# Altium schematic sheet 纠偏机电路图(TZ).SchDoc
size B; SheetNumber: 0; SheetTotal: 0
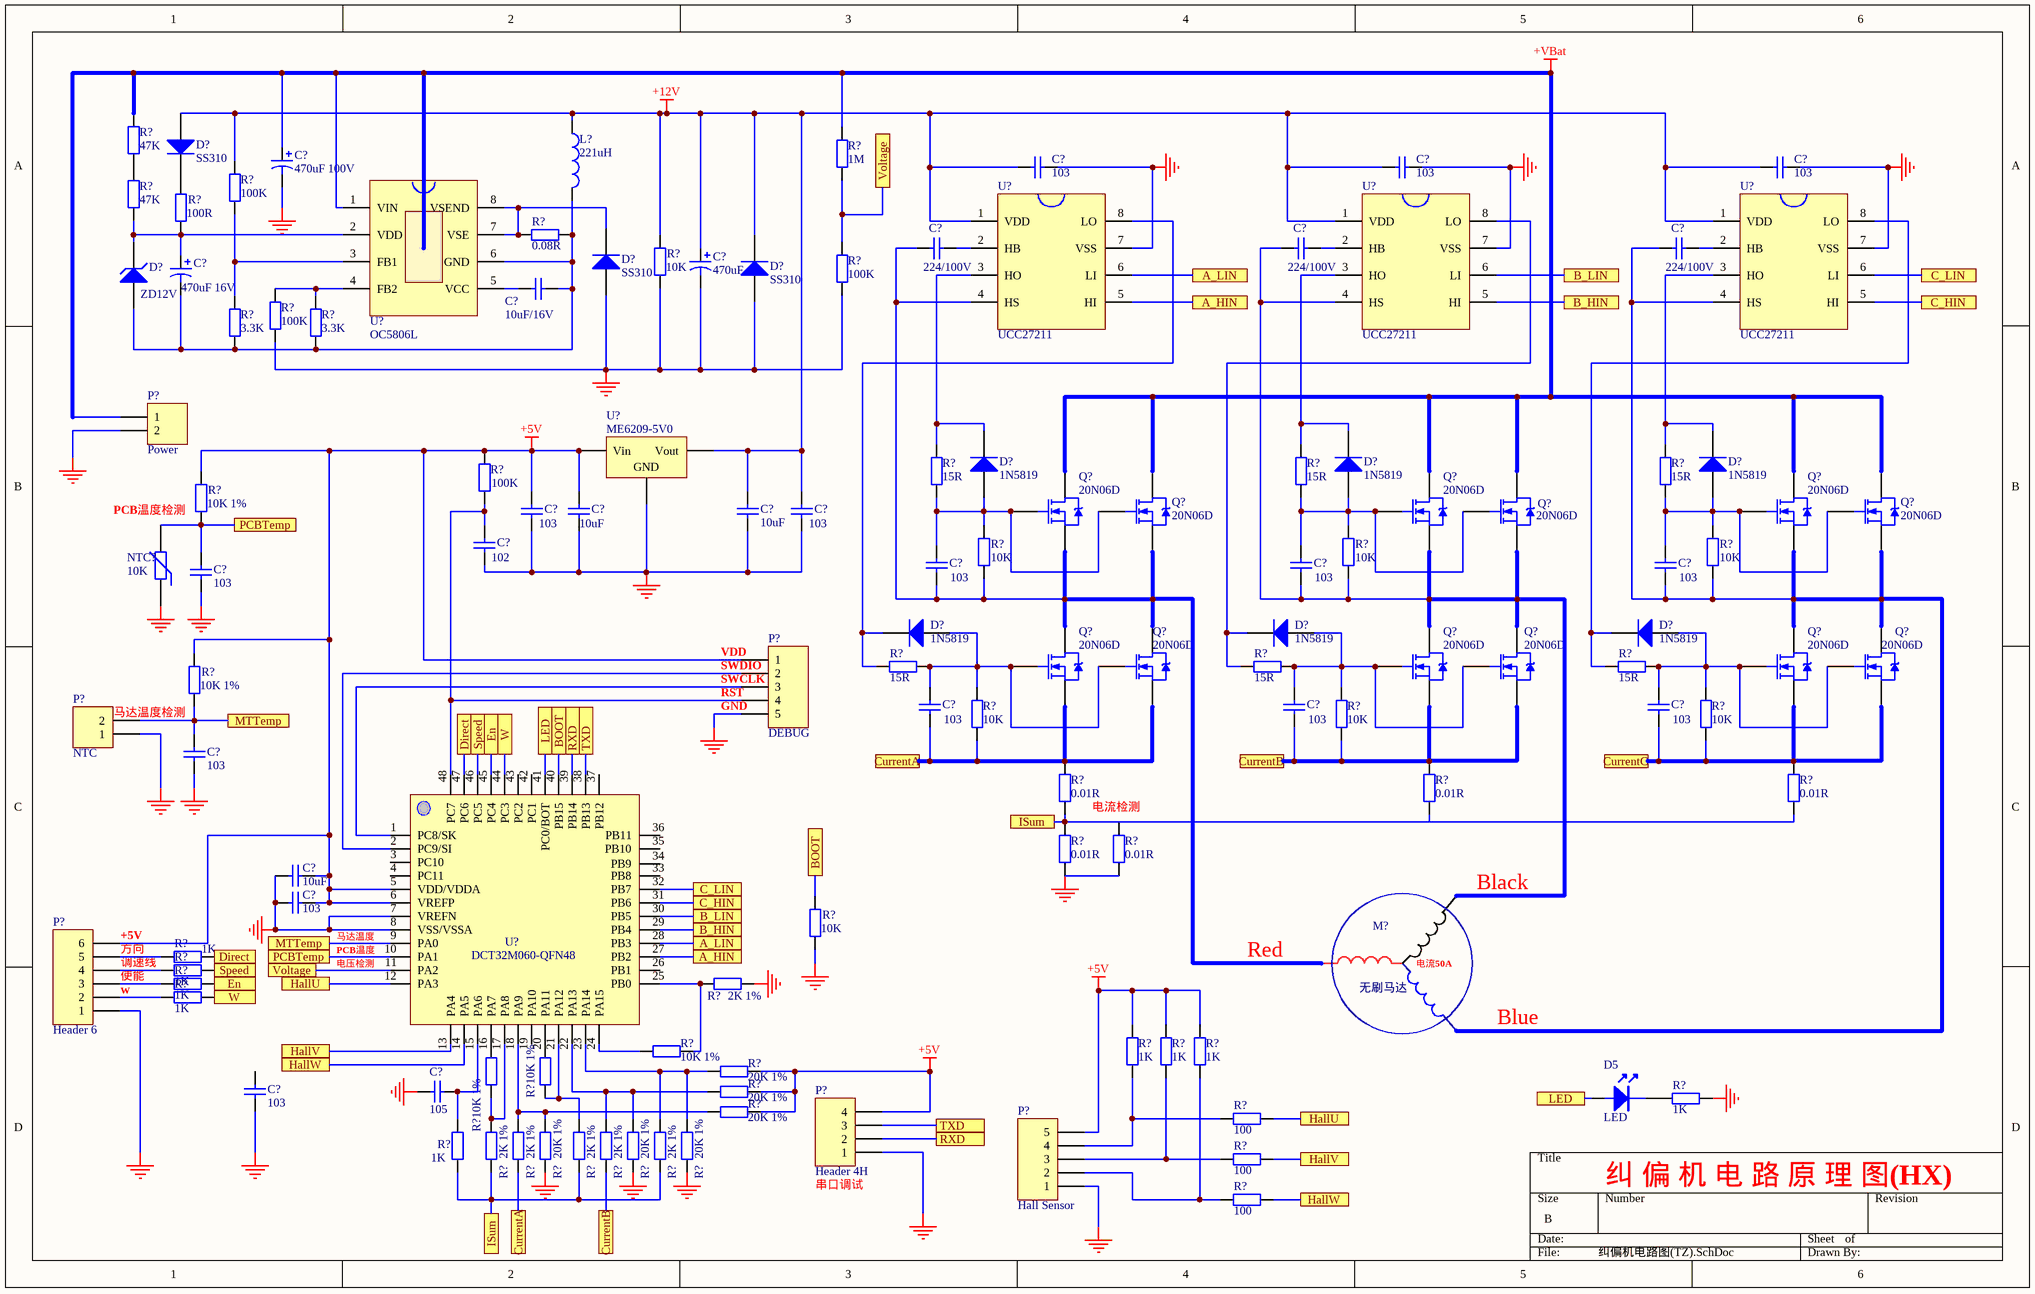
[diagram p0: 纠偏机电路图(TZ).SchDoc]

## Parts
(Parts that share a designator on the sheet are numbered #1, #2 ... from top to bottom, then left to right.)
C?#1  value 470uF 100V  [C0805]  (hidden comment: Cap Pol3)
C?#2  value 103  [RAD-0.3]
C?#3  value 103  [RAD-0.3]
C?#4  value 103  [RAD-0.3]
C?#5  value 224/100V  [RAD-0.3]
C?#6  value 224/100V  [RAD-0.3]
C?#7  value 224/100V  [RAD-0.3]
C?#8  value 470uF  [C0805]  (hidden comment: Cap Pol3)
C?#9  value 470uF 16V  [C0805]  (hidden comment: Cap Pol3)
C?#10  value 10uF/16V  [RAD-0.3]  (hidden comment: Cap)
C?#11  value 10uF  [RAD-0.3]
C?#12  value 103  [RAD-0.3]
C?#13  value 10uF  [RAD-0.3]  (hidden comment: Cap)
C?#14  value 103  [RAD-0.3]
C?#15  value 102  [RAD-0.3]
C?#16  value 103  [RAD-0.3]
C?#17  value 103  [RAD-0.3]
C?#18  value 103  [RAD-0.3]
C?#19  value 103  [RAD-0.3]  (hidden comment: Cap)
C?#20  value 103  [RAD-0.3]
C?#21  value 103  [RAD-0.3]
C?#22  value 103  [RAD-0.3]
C?#23  value 103  [RAD-0.3]  (hidden comment: Cap)
C?#24  value 10uF  [RAD-0.3]  (hidden comment: Cap)
C?#25  value 103  [RAD-0.3]  (hidden comment: Cap)
C?#26  value 103  [RAD-0.3]  (hidden comment: Cap)
C?#27  value 105  [RAD-0.3]  (hidden comment: Cap)
D5  LED  [LED]
D?#1  SS310  [SMC]
D?#2  SS310  [SMC]
D?#3  SS310  [SMC]
D?#4  ZD12V  [DIODE-0.7]
D?#5  1N5819  [SMC]
D?#6  1N5819  [SMC]
D?#7  1N5819  [SMC]
D?#8  1N5819  [SMC]
D?#9  1N5819  [SMC]
D?#10  1N5819  [SMC]
L?  value 221uH  [0402-A]  (hidden comment: Inductor)
M?  无刷马达
NTC?  10K  [6-0805_N]
P?#1  Power  [HDR1X2]
P?#2  DEBUG  [HDR1X5]
P?#3  NTC  [HDR1X2]
P?#4  Header 6  [HDR1X6]
P?#5  Header 4H  [HDR1X4H]
P?#6  Hall Sensor  [HDR1X5]
Q?#1  20N06D  [TO-220AB]
Q?#2  20N06D  [TO-220AB]
Q?#3  20N06D  [TO-220AB]
Q?#4  20N06D  [TO-220AB]
Q?#5  20N06D  [TO-220AB]
Q?#6  20N06D  [TO-220AB]
Q?#7  20N06D  [TO-220AB]
Q?#8  20N06D  [TO-220AB]
Q?#9  20N06D  [TO-220AB]
Q?#10  20N06D  [TO-220AB]
Q?#11  20N06D  [TO-220AB]
Q?#12  20N06D  [TO-220AB]
R?#1  value 47K  [AXIAL-0.4]  (hidden comment: Res2)
R?#2  value 1M  [AXIAL-0.4]  (hidden comment: Res2)
R?#3  value 100K  [AXIAL-0.4]  (hidden comment: Res2)
R?#4  value 47K  [AXIAL-0.4]  (hidden comment: Res2)
R?#5  value 100R  [AXIAL-0.4]  (hidden comment: Res2)
R?#6  value 0.08R  [AXIAL-0.4]  (hidden comment: Res2)
R?#7  value 10K  [AXIAL-0.4]  (hidden comment: Res2)
R?#8  value 100K  [AXIAL-0.4]  (hidden comment: Res2)
R?#9  value 100K  [AXIAL-0.4]  (hidden comment: Res2)
R?#10  value 3.3K  [AXIAL-0.4]  (hidden comment: Res2)
R?#11  value 3.3K  [AXIAL-0.4]  (hidden comment: Res2)
R?#12  value 10K 1%  [AXIAL-0.4]  (hidden comment: Res2)
R?#13  value 15R  [AXIAL-0.4]  (hidden comment: Res2)
R?#14  value 15R  [AXIAL-0.4]  (hidden comment: Res2)
R?#15  value 15R  [AXIAL-0.4]  (hidden comment: Res2)
R?#16  value 100K  [AXIAL-0.4]  (hidden comment: Res2)
R?#17  value 10K  [AXIAL-0.4]  (hidden comment: Res2)
R?#18  value 10K  [AXIAL-0.4]  (hidden comment: Res2)
R?#19  value 10K  [AXIAL-0.4]  (hidden comment: Res2)
R?#20  value 10K 1%  [AXIAL-0.4]  (hidden comment: Res2)
R?#21  value 15R  [AXIAL-0.4]  (hidden comment: Res2)
R?#22  value 15R  [AXIAL-0.4]  (hidden comment: Res2)
R?#23  value 15R  [AXIAL-0.4]  (hidden comment: Res2)
R?#24  value 10K  [AXIAL-0.4]  (hidden comment: Res2)
R?#25  value 10K  [AXIAL-0.4]  (hidden comment: Res2)
R?#26  value 10K  [AXIAL-0.4]  (hidden comment: Res2)
R?#27  value 0.01R  [AXIAL-0.4]  (hidden comment: Res2)
R?#28  value 0.01R  [AXIAL-0.4]  (hidden comment: Res2)
R?#29  value 0.01R  [AXIAL-0.4]  (hidden comment: Res2)
R?#30  value 0.01R  [AXIAL-0.4]  (hidden comment: Res2)
R?#31  value 0.01R  [AXIAL-0.4]  (hidden comment: Res2)
R?#32  value 10K  [AXIAL-0.4]  (hidden comment: Res2)
R?#33  value 1K  [AXIAL-0.4]  (hidden comment: Res2)
R?#34  value 1K  [AXIAL-0.4]  (hidden comment: Res2)
R?#35  value 1K  [AXIAL-0.4]  (hidden comment: Res2)
R?#36  value 1K  [AXIAL-0.4]  (hidden comment: Res2)
R?#37  value 2K 1%  [AXIAL-0.4]  (hidden comment: Res2)
R?#38  value 10K 1%  [AXIAL-0.4]  (hidden comment: Res2)
R?#39  value 1K  [AXIAL-0.4]  (hidden comment: Res2)
R?#40  value 1K  [AXIAL-0.4]  (hidden comment: Res2)
R?#41  value 1K  [AXIAL-0.4]  (hidden comment: Res2)
R?#42  value 10K 1%  [AXIAL-0.4]  (hidden comment: Res2)
R?#43  value 10K 1%  [AXIAL-0.4]  (hidden comment: Res2)
R?#44  value 20K 1%  [AXIAL-0.4]  (hidden comment: Res2)
R?#45  value 1K  [AXIAL-0.4]  (hidden comment: Res2)
R?#46  value 20K 1%  [AXIAL-0.4]  (hidden comment: Res2)
R?#47  value 20K 1%  [AXIAL-0.4]  (hidden comment: Res2)
R?#48  value 1K  [AXIAL-0.4]  (hidden comment: Res2)
R?#49  value 2K 1%  [AXIAL-0.4]  (hidden comment: Res2)
R?#50  value 20K 1%  [AXIAL-0.4]  (hidden comment: Res2)
R?#51  value 100  [AXIAL-0.4]  (hidden comment: Res2)
R?#52  value 2K 1%  [AXIAL-0.4]  (hidden comment: Res2)
R?#53  value 2K 1%  [AXIAL-0.4]  (hidden comment: Res2)
R?#54  value 20K 1%  [AXIAL-0.4]  (hidden comment: Res2)
R?#55  value 2K 1%  [AXIAL-0.4]  (hidden comment: Res2)
R?#56  value 2K 1%  [AXIAL-0.4]  (hidden comment: Res2)
R?#57  value 20K 1%  [AXIAL-0.4]  (hidden comment: Res2)
R?#58  value 100  [AXIAL-0.4]  (hidden comment: Res2)
R?#59  value 100  [AXIAL-0.4]  (hidden comment: Res2)
U?#1  OC5806L
U?#2  UCC27211
U?#3  UCC27211
U?#4  UCC27211
U?#5  ME6209-5V0  [D2PAK_N]
U?#6  DCT32M060-QFN48

## Ports
A_HIN, A_LIN, B_HIN, B_LIN, BOOT, C_HIN, C_LIN, CurrentA, CurrentB, CurrentC, Direct, En, HallU, HallV, HallW, ISum, LED, MTTemp, PCBTemp, RXD, Speed, TXD, Voltage, W

## Nets
+5V: C?#11.1 C?#12.2 C?#24.2 C?#25.1 P?#2.1 P?#4.6 P?#5.4 P?#6.5 R?#12.1 R?#16.2 R?#20.1 R?#39.2 R?#40.2 R?#41.2 R?#44.1 R?#46.1 R?#47.1 U?#5.1(Vin) U?#6.5(VDD/VDDA) U?#6.6(VREFP)
+12V: C?#2.2 C?#3.2 C?#4.2 C?#8.1 C?#13.2 C?#14.2 D?#1.1(A) D?#3.2(K) L?.1 R?#3.2 R?#7.1 U?#2.1(VDD) U?#3.1(VDD) U?#4.1(VDD) U?#5.3(Vout)
+VBat: C?#1.1 Q?#1.2(D) Q?#2.2(D) Q?#3.2(D) Q?#4.2(D) Q?#5.2(D) Q?#6.2(D) R?#1.1 R?#2.2 U?#1.1(VIN) U?#1.9
GND: C?#1.2 C?#2.1 C?#3.1 C?#4.1 C?#8.2 C?#11.2 C?#12.1 C?#13.1 C?#14.1 C?#15.1 C?#19.1 C?#23.1 C?#24.1 C?#25.2 C?#26.1 C?#27.2 D?#2.1(A) D?#3.1(A) NTC?.1 P?#2.5 P?#3.1 P?#4.1 P?#5.1 P?#6.1 R?#7.2 R?#8.1 R?#9.2 R?#30.2 R?#32.2 R?#37.1 R?#45.2 R?#50.2 R?#54.1 R?#57.1 U?#2.7(VSS) U?#3.7(VSS) U?#4.7(VSS) U?#5.2(GND) U?#6.7(VREFN) U?#6.8(VSS/VSSA)
A_HIN: U?#2.5(HI) U?#6.27(PB2) ; port A_HIN
A_LIN: U?#2.6(LI) U?#6.28(PB3) ; port A_LIN
B_HIN: U?#3.5(HI) U?#6.29(PB4) ; port B_HIN
B_LIN: U?#3.6(LI) U?#6.30(PB5) ; port B_LIN
BOOT: R?#32.1 U?#6.40(PB15) ; port BOOT
C_HIN: U?#4.5(HI) U?#6.31(PB6) ; port C_HIN
C_LIN: U?#4.6(LI) U?#6.32(PB7) ; port C_LIN
CurrentA: C?#20.2 Q?#7.3(S) Q?#8.3(S) R?#24.1 R?#27.1 R?#53.1 ; port CurrentA
CurrentB: C?#21.2 Q?#9.3(S) Q?#10.3(S) R?#25.1 R?#28.1 R?#56.1 ; port CurrentB
CurrentC: C?#22.2 Q?#11.3(S) Q?#12.3(S) R?#26.1 R?#29.1 ; port CurrentC
Direct: R?#33.2 U?#6.47(PC6) ; port Direct
En: R?#35.2 U?#6.45(PC4) ; port En
HallU: R?#51.1 U?#6.12(PA3) ; port HallU
HallV: R?#58.1 U?#6.13(PA4) ; port HallV
HallW: R?#59.1 U?#6.14(PA5) ; port HallW
ISum: R?#30.1 R?#48.2 R?#49.2 R?#52.1 R?#55.1 ; port ISum
LED: D5.1 U?#6.41(PC0/BOT) ; port LED
MTTemp: C?#23.2 P?#3.2 R?#20.2 U?#6.9(PA0) ; port MTTemp
PCBTemp: C?#19.2 NTC?.2 R?#12.2 U?#6.10(PA1) ; port PCBTemp
RXD: P?#5.2 U?#6.39(PB14) ; port RXD
Speed: R?#34.2 U?#6.46(PC5) ; port Speed
TXD: P?#5.3 U?#6.38(PB13) ; port TXD
Voltage: R?#2.1 R?#8.2 U?#6.11(PA2) ; port Voltage
W: R?#36.2 U?#6.44(PC3) ; port W
NetC?#5_1: C?#5.1 C?#16.2 Q?#1.3(S) Q?#2.3(S) Q?#7.2(D) Q?#8.2(D) R?#17.1 U?#2.4(HS)
NetC?#5_2: C?#5.2 U?#2.2(HB)
NetC?#6_1: C?#6.1 C?#17.2 Q?#3.3(S) Q?#4.3(S) Q?#9.2(D) Q?#10.2(D) R?#18.1 U?#3.4(HS)
NetC?#6_2: C?#6.2 U?#3.2(HB)
NetC?#7_1: C?#7.1 C?#18.2 Q?#5.3(S) Q?#6.3(S) Q?#11.2(D) Q?#12.2(D) R?#19.1 U?#4.4(HS)
NetC?#7_2: C?#7.2 U?#4.2(HB)
NetC?#9_1: C?#9.1 D?#4.2(K) R?#4.1 R?#5.1 U?#1.2(VDD)
NetC?#9_2: C?#9.2 C?#10.1 D?#4.1(A) L?.2 R?#6.1 R?#10.2 R?#11.2 U?#1.6(GND)
NetC?#10_2: C?#10.2 U?#1.5(VCC)
NetC?#15_2: C?#15.2 P?#2.4 R?#16.1 U?#6.48(PC7)
NetC?#16_1: C?#16.1 D?#5.1(A) Q?#1.1(G) Q?#2.1(G) R?#13.1 R?#17.2
NetC?#17_1: C?#17.1 D?#6.1(A) Q?#3.1(G) Q?#4.1(G) R?#14.1 R?#18.2
NetC?#18_1: C?#18.1 D?#7.1(A) Q?#5.1(G) Q?#6.1(G) R?#15.1 R?#19.2
NetC?#20_1: C?#20.1 D?#8.1(A) Q?#7.1(G) Q?#8.1(G) R?#21.1 R?#24.2
NetC?#21_1: C?#21.1 D?#9.1(A) Q?#9.1(G) Q?#10.1(G) R?#22.1 R?#25.2
NetC?#22_1: C?#22.1 D?#10.1(A) Q?#11.1(G) Q?#12.1(G) R?#23.1 R?#26.2
NetC?#27_1: C?#27.1 R?#48.1 U?#6.15(PA6)
NetD5_2: D5.2 R?#45.1
NetD?#1_2: D?#1.2(K) R?#5.2
NetD?#2_2: D?#2.2(K) R?#6.2 U?#1.7(VSE) U?#1.8(VSEND)
NetD?#5_2: D?#5.2(K) R?#13.2 U?#2.3(HO)
NetD?#6_2: D?#6.2(K) R?#14.2 U?#3.3(HO)
NetD?#7_2: D?#7.2(K) R?#15.2 U?#4.3(HO)
NetD?#8_2: D?#8.2(K) R?#21.2 U?#2.8(LO)
NetD?#9_2: D?#9.2(K) R?#22.2 U?#3.8(LO)
NetD?#10_2: D?#10.2(K) R?#23.2 U?#4.8(LO)
NetP?#2_2: P?#2.2 U?#6.2(PC9/SI)
NetP?#2_3: P?#2.3 U?#6.1(PC8/SK)
NetP?#4_2: P?#4.2 R?#36.1
NetP?#4_3: P?#4.3 R?#35.1
NetP?#4_4: P?#4.4 R?#34.1
NetP?#4_5: P?#4.5 R?#33.1
NetP?#6_2: P?#6.2 R?#41.1 R?#59.2
NetP?#6_3: P?#6.3 R?#40.1 R?#58.2
NetP?#6_4: P?#6.4 R?#39.1 R?#51.2
NetR?#1_2: R?#1.2 R?#4.2
NetR?#3_1: R?#3.1 R?#10.1 U?#1.3(FB1)
NetR?#9_1: R?#9.1 R?#11.1 U?#1.4(FB2)
NetR?#37_2: R?#37.2 R?#38.1 U?#6.25(PB0)
NetR?#38_2: R?#38.2 U?#6.24(PA15)
NetR?#42_1: R?#42.1 R?#52.2 U?#6.17(PA8)
NetR?#42_2: R?#42.2 U?#6.16(PA7)
NetR?#43_1: R?#43.1 R?#55.2 U?#6.21(PA12)
NetR?#43_2: R?#43.2 U?#6.20(PA11)
NetR?#44_2: R?#44.2 R?#49.1 R?#50.1 U?#6.23(PA14)
NetR?#46_2: R?#46.2 R?#56.2 R?#57.2 U?#6.22(PA13)
NetR?#47_2: R?#47.2 R?#53.2 R?#54.2 U?#6.18(PA9)

Not connected (* = marked no-connect by the designer): C?#26 2; P?#1 1 2; R?#27 2; R?#28 2; R?#29 2; R?#31 1 2; U?#6 3(PC10) 4(PC11) 19(PA10) 26(PB1) 33(PB8) 34(PB9) 35(PB10) 36(PB11) 37(PB12) 42(PC1) 43(PC2)

## Notes on the sheet
- PCB温度检测
- (near P?#2) VDD
- (near P?#2) RST
- (near P?#2) SWCLK
- (near P?#2) SWDIO
- (near P?#3) 马达温度检测
- (near P?#2) GND
- (near R?#31) 电流检测
- Black
- +5V
- 方向
- 调速线
- 电压检测
- 马达温度
- PCB温度
- Red
- (near M?) 电流50A
- (near P?#4) W
- 使能
- Blue
- (near P?#5) 串口调试
- 纠 偏 机 电 路 原 理 图(HX)
- Labels drawn without touching a wire or pin: GND

## Library data of the parts
C?#1 C?#8 C?#9 = Cap Pol3: Polarized Capacitor (Surface Mount); Published: 8-Jun-2000; LatestRevisionDate: 29-May-2009; LatestRevisionNote: IPC-7351 Footprint Added.; PackageReference: C0805; Publisher: Altium Limited; PackageDescription: Chip Capacitor
C?#2-C?#7 C?#10-C?#27 = Cap: Capacitor; Published: 8-Jun-2000; LatestRevisionDate: 17-Jul-2002; LatestRevisionNote: Re-released for DXP Platform.; PackageReference: RAD-0.3; Publisher: Altium Limited; PackageDescription: Radial Cap, Thru-Hole; 2 Leads; 0.3 in Pin Spacing
D?#1-D?#3 D?#5-D?#10 = Diode: Default Diode; Published: 8-Jun-2000; LatestRevisionDate: 17-Jul-2002; LatestRevisionNote: Re-released for DXP Platform.; PackageVersion: Sep-1996; PackageReference: SMC; Publisher: Altium Limited; PackageDescription: DO-214-AB/SMC; 2 C-Bend Leads; Body 7.9 x 5.9 mm, inc. leads (LxW); Code_JEDEC: DO-214-AB
D?#4 = D Zener: Zener Diode; Published: 8-Jun-2000; LatestRevisionDate: 17-Jul-2002; LatestRevisionNote: Re-released for DXP Platform.; PackageReference: DIODE-0.7; Publisher: Altium Limited; PackageDescription: Diode, Thru-Hole; 2 Leads; 0.7 in Pin Spacing
L? = Inductor: Code_IEC: 1005; Published: 8-Jun-2000; LatestRevisionDate: 29-May-2009; LatestRevisionNote: IPC-7351 Footprint Added.; PackageReference: 0402-A; Publisher: Altium Limited; PackageDescription: Chip Inductor; Code_JEITA: 0402
M? = MOTOR  BRUSHLESS: Brushless  Motor
NTC? = Res Varistor: Varistor (Voltage-Sensitive Resistor); Published: 24-Mar-1999; LatestRevisionDate: 29-May-2009; LatestRevisionNote: IPC-7351 Footprint Added.; PackageVersion: Mar-2003; PackageReference: 6-0805; Publisher: Altium Limited; PackageDescription: Chip Resistor 0805 Case Size; Code_IPC: RESC2012
P?#1 P?#3 = Header 2: Header, 2-Pin; LatestRevisionDate: 17-Jul-2002; LatestRevisionNote: Re-released for DXP Platform.; Publisher: Altium Limited
P?#2 P?#6 = Header 5: Header, 5-Pin; LatestRevisionDate: 17-Jul-2002; LatestRevisionNote: Re-released for DXP Platform.; Publisher: Altium Limited
P?#4 = Header 6: Header, 6-Pin; LatestRevisionDate: 17-Jul-2002; LatestRevisionNote: Re-released for DXP Platform.; Publisher: Altium Limited
P?#5 = Header 4H: Header, 4-Pin, Right Angle; LatestRevisionDate: 17-Jul-2002; LatestRevisionNote: Re-released for DXP Platform.; Publisher: Altium Limited
Q?#1-Q?#12 = NMOS-2: N-Channel Power MOSFET; Note: Pin 2 is electrically connected to pin 4.; Published: 8-Jun-2000; LatestRevisionDate: 17-Jul-2002; LatestRevisionNote: Re-released for DXP Platform.; DatasheetVersion: PD-9.814; PackageVersion: Feb-1997; PackageReference: TO-220AB; Publisher: Altium Limited; PackageDescription: TO, Thru-Hole, Vertical, Heatsink Mounted; 3 In-Line Leads; Pitch 2.54 mm; ComponentLink1Description: Manufacturer Link; ComponentLink1URL: http://www.irf.com/
R?#1-R?#59 = Res2: Resistor; Published: 8-Jun-2000; LatestRevisionDate: 17-Jul-2002; LatestRevisionNote: Re-released for DXP Platform.; PackageReference: AXIAL-0.4; Publisher: Altium Limited; PackageDescription: Axial Device, Thru-Hole; 2 Leads; 0.4 in Pin Spacing
U?#5 = Volt Reg: Voltage Regulator; Published: 24-Mar-1999; LatestRevisionDate: 29-May-2009; LatestRevisionNote: IPC-7351 Footprint Added.; PackageReference: D2PAK; Publisher: Altium Limited; PackageDescription: 3-Pin Transistor Outline Package 2.54 mm Pitch, 15.1 mm Lead Span